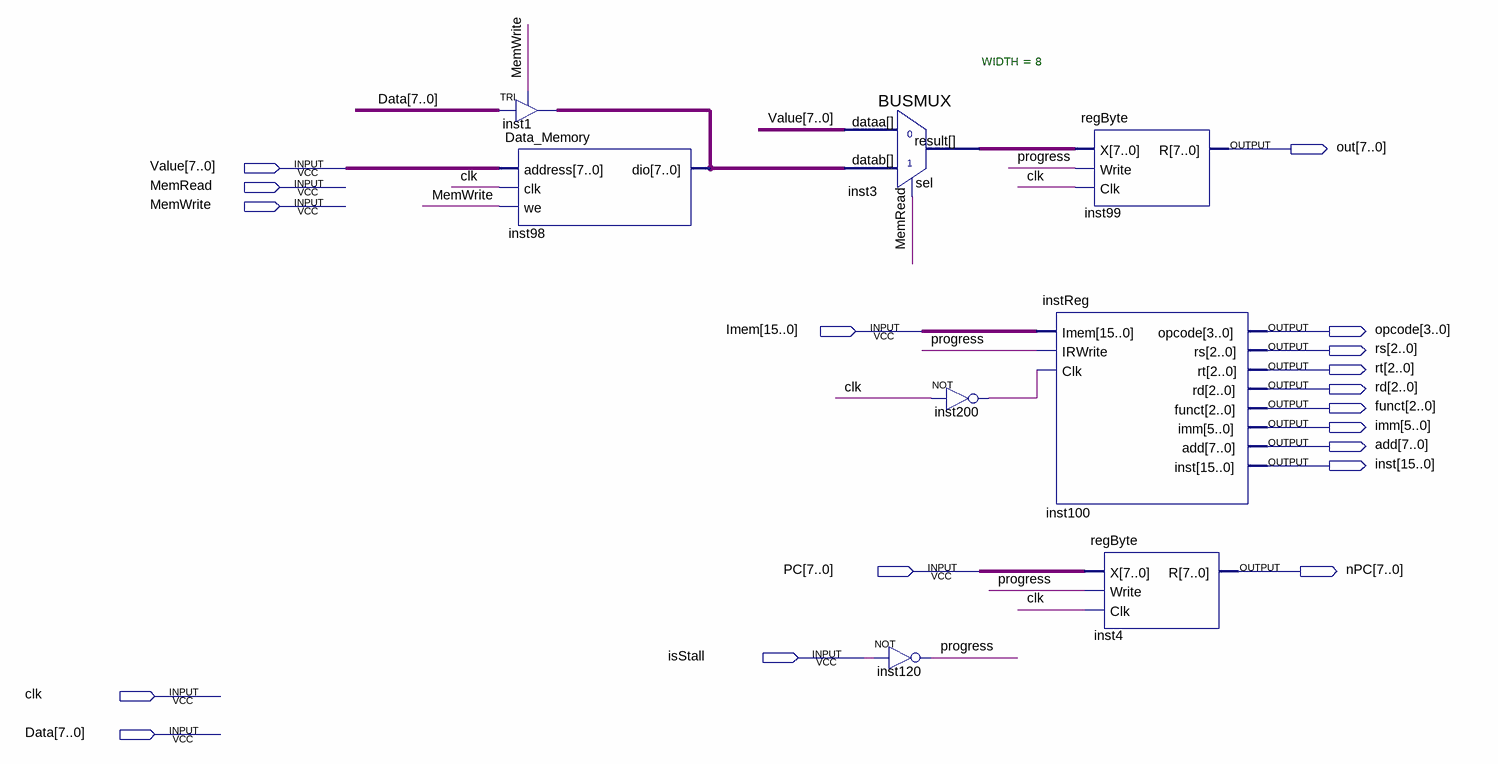
[diagram p0: schematic sheet]
// Quartus schematic DataFetchCycle.bdf as structural Verilog: 8 symbols, 18 pins
module DataFetchCycle (
  input  [7:0] Value,
  input  MemRead,
  input  MemWrite,
  input  [15:0] Imem,
  input  [7:0] PC,
  input  isStall,
  input  clk,
  input  [7:0] Data,
  output [7:0] out,
  output [3:0] opcode,
  output [2:0] rs,
  output [2:0] rt,
  output [2:0] rd,
  output [2:0] funct,
  output [5:0] imm,
  output [7:0] add,
  output [15:0] inst,
  output [7:0] nPC
);

  wire inst200_out, progress;
  wire [7:0] inst1_out, inst3_result;

  TRI inst1[7:0] (.IN(Data), .OE(MemWrite), .OUT(inst1_out));
  Data_Memory inst98 (.address(Value), .clk(clk), .we(MemWrite), .dio(inst1_out));
  BUSMUX #(.WIDTH(8)) inst3 (.datab(inst1_out), .sel(MemRead), .dataa(Value), .result(inst3_result));
  not inst200 (inst200_out, clk);
  not inst120 (progress, isStall);
  regByte inst99 (.X(inst3_result), .Write(progress), .Clk(clk), .R(out));
  instReg inst100 (
    .Imem(Imem), .IRWrite(progress), .Clk(inst200_out), .opcode(opcode), .rs(rs), .rt(rt), .rd(rd),
    .funct(funct), .imm(imm), .add(add), .inst(inst));
  regByte inst4 (.X(PC), .Write(progress), .Clk(clk), .R(nPC));
endmodule
